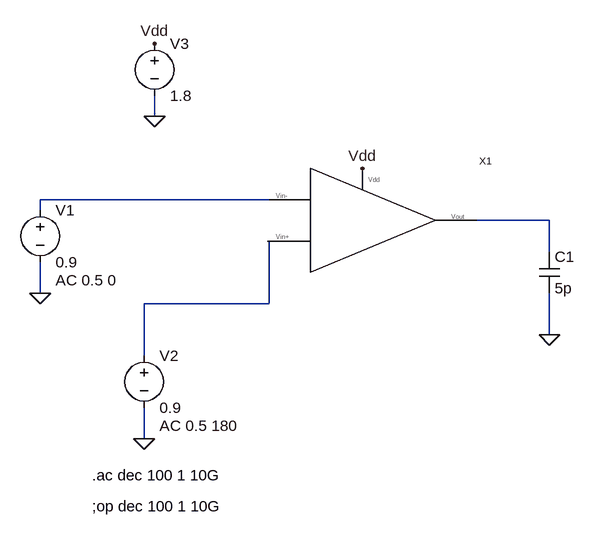
[diagram p0: schematic opamp_ac_simulation.asc]
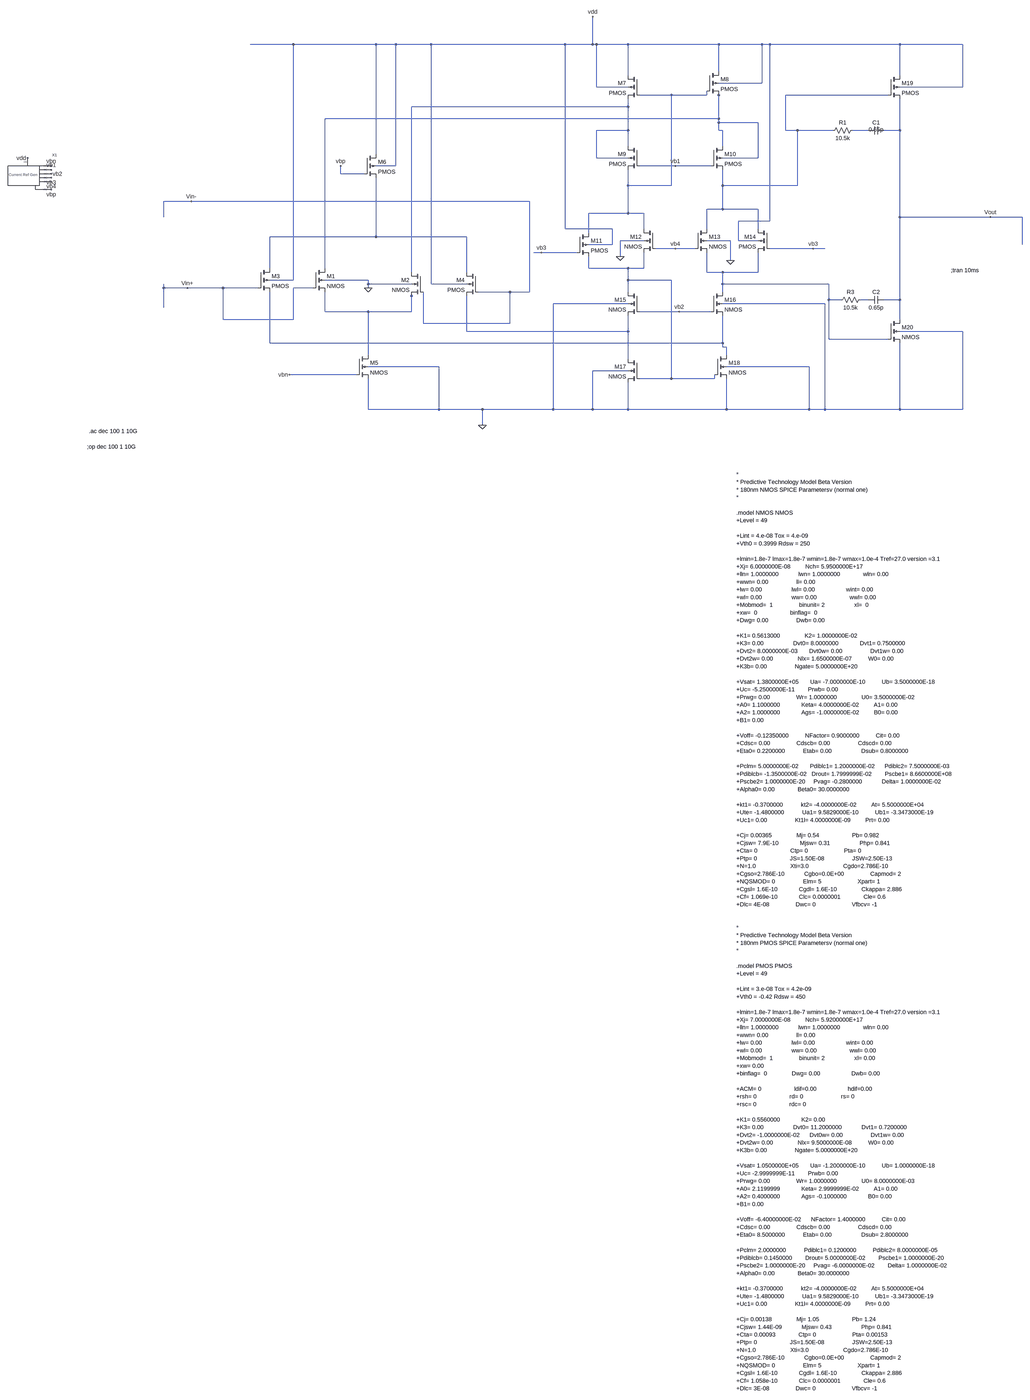
[diagram p1: sub-circuit rail_to_rail_opamp_withclassab_108.5db.asc, whole sheet]
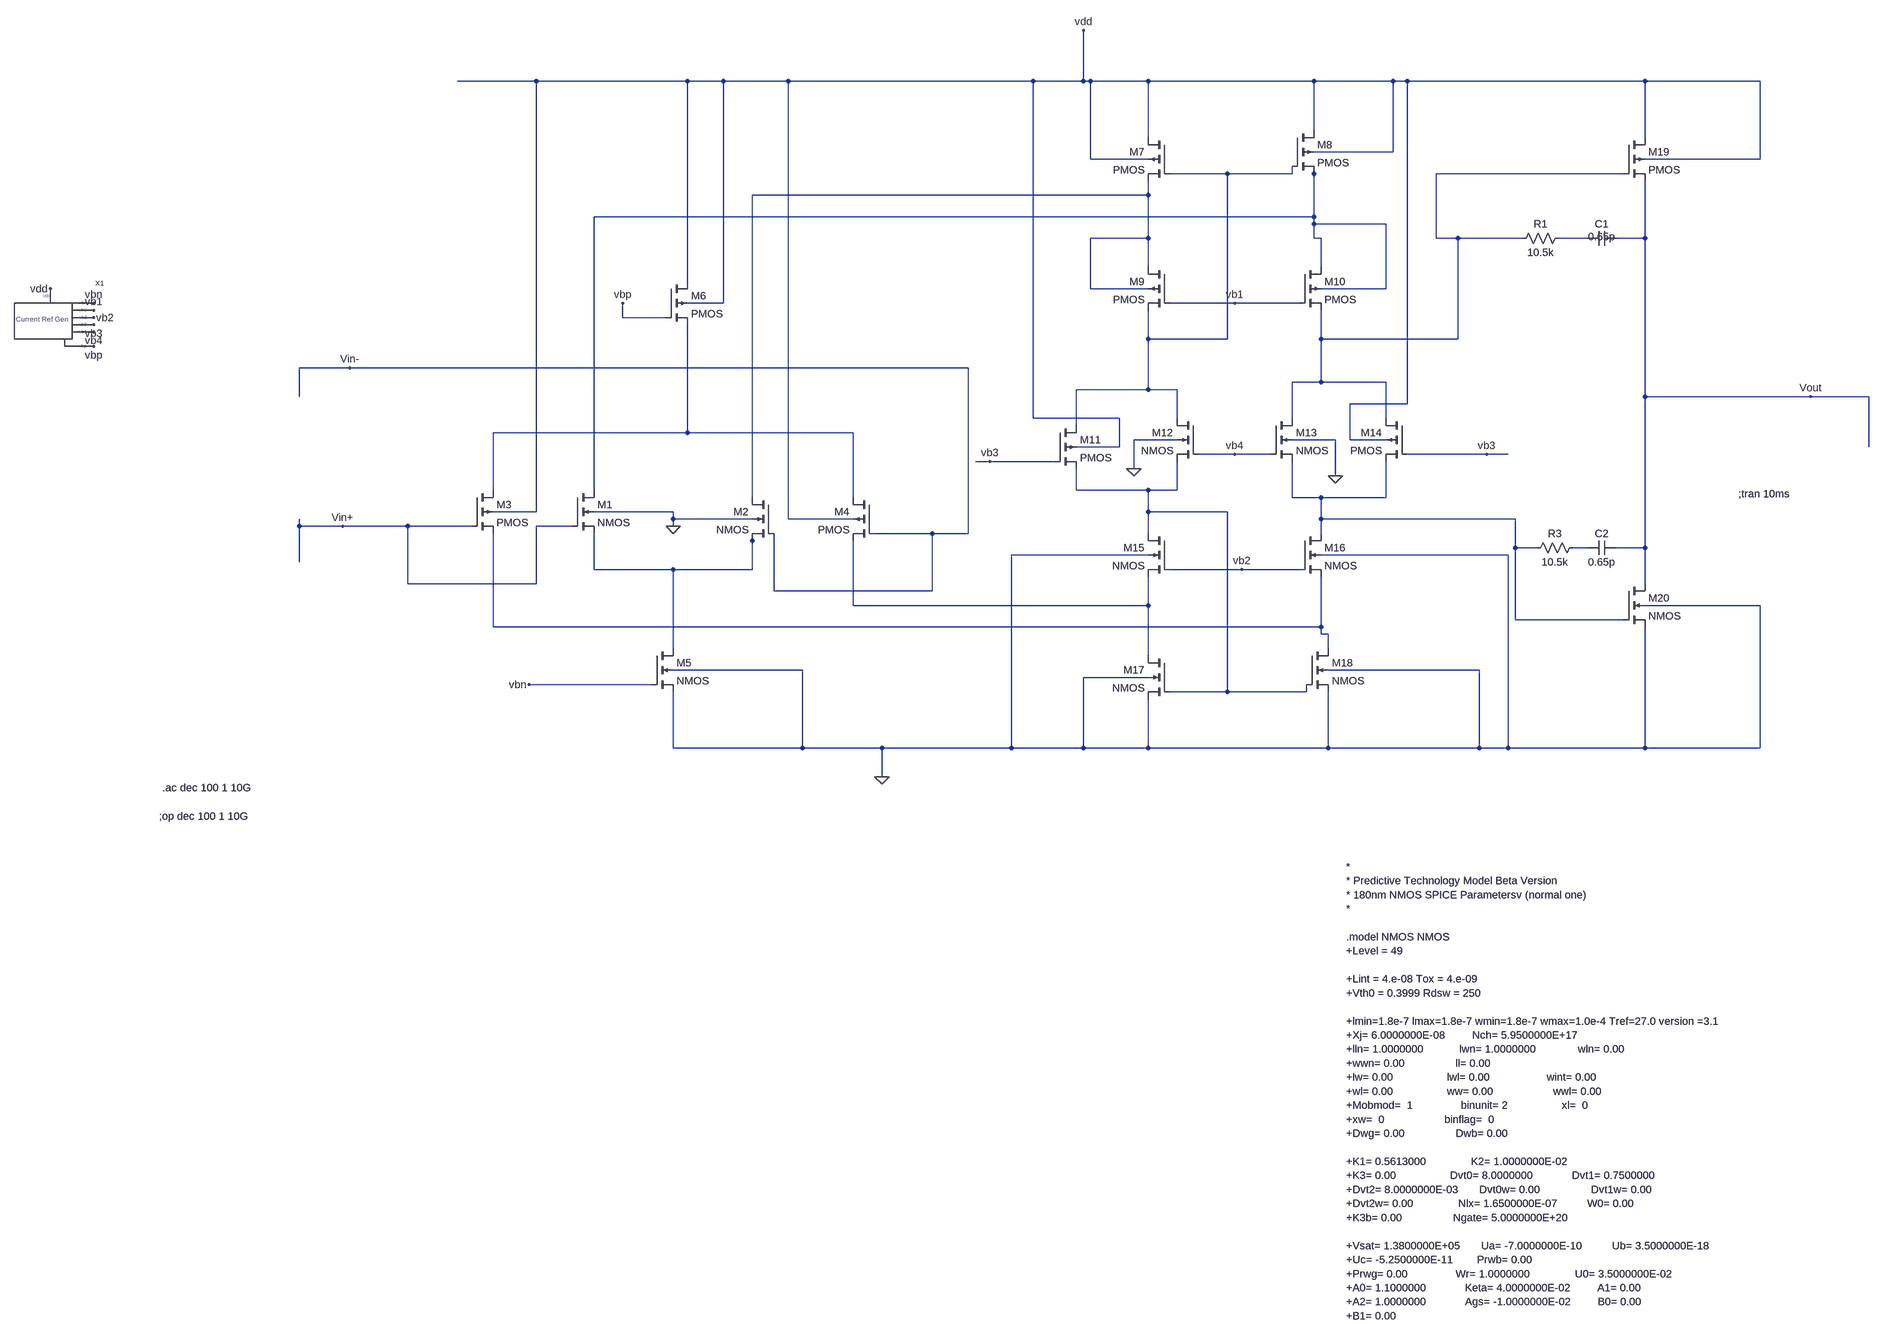
[diagram p2: sub-circuit rail_to_rail_opamp_withclassab_108.5db.asc, part, row 1 of 2, column 1 of 1]
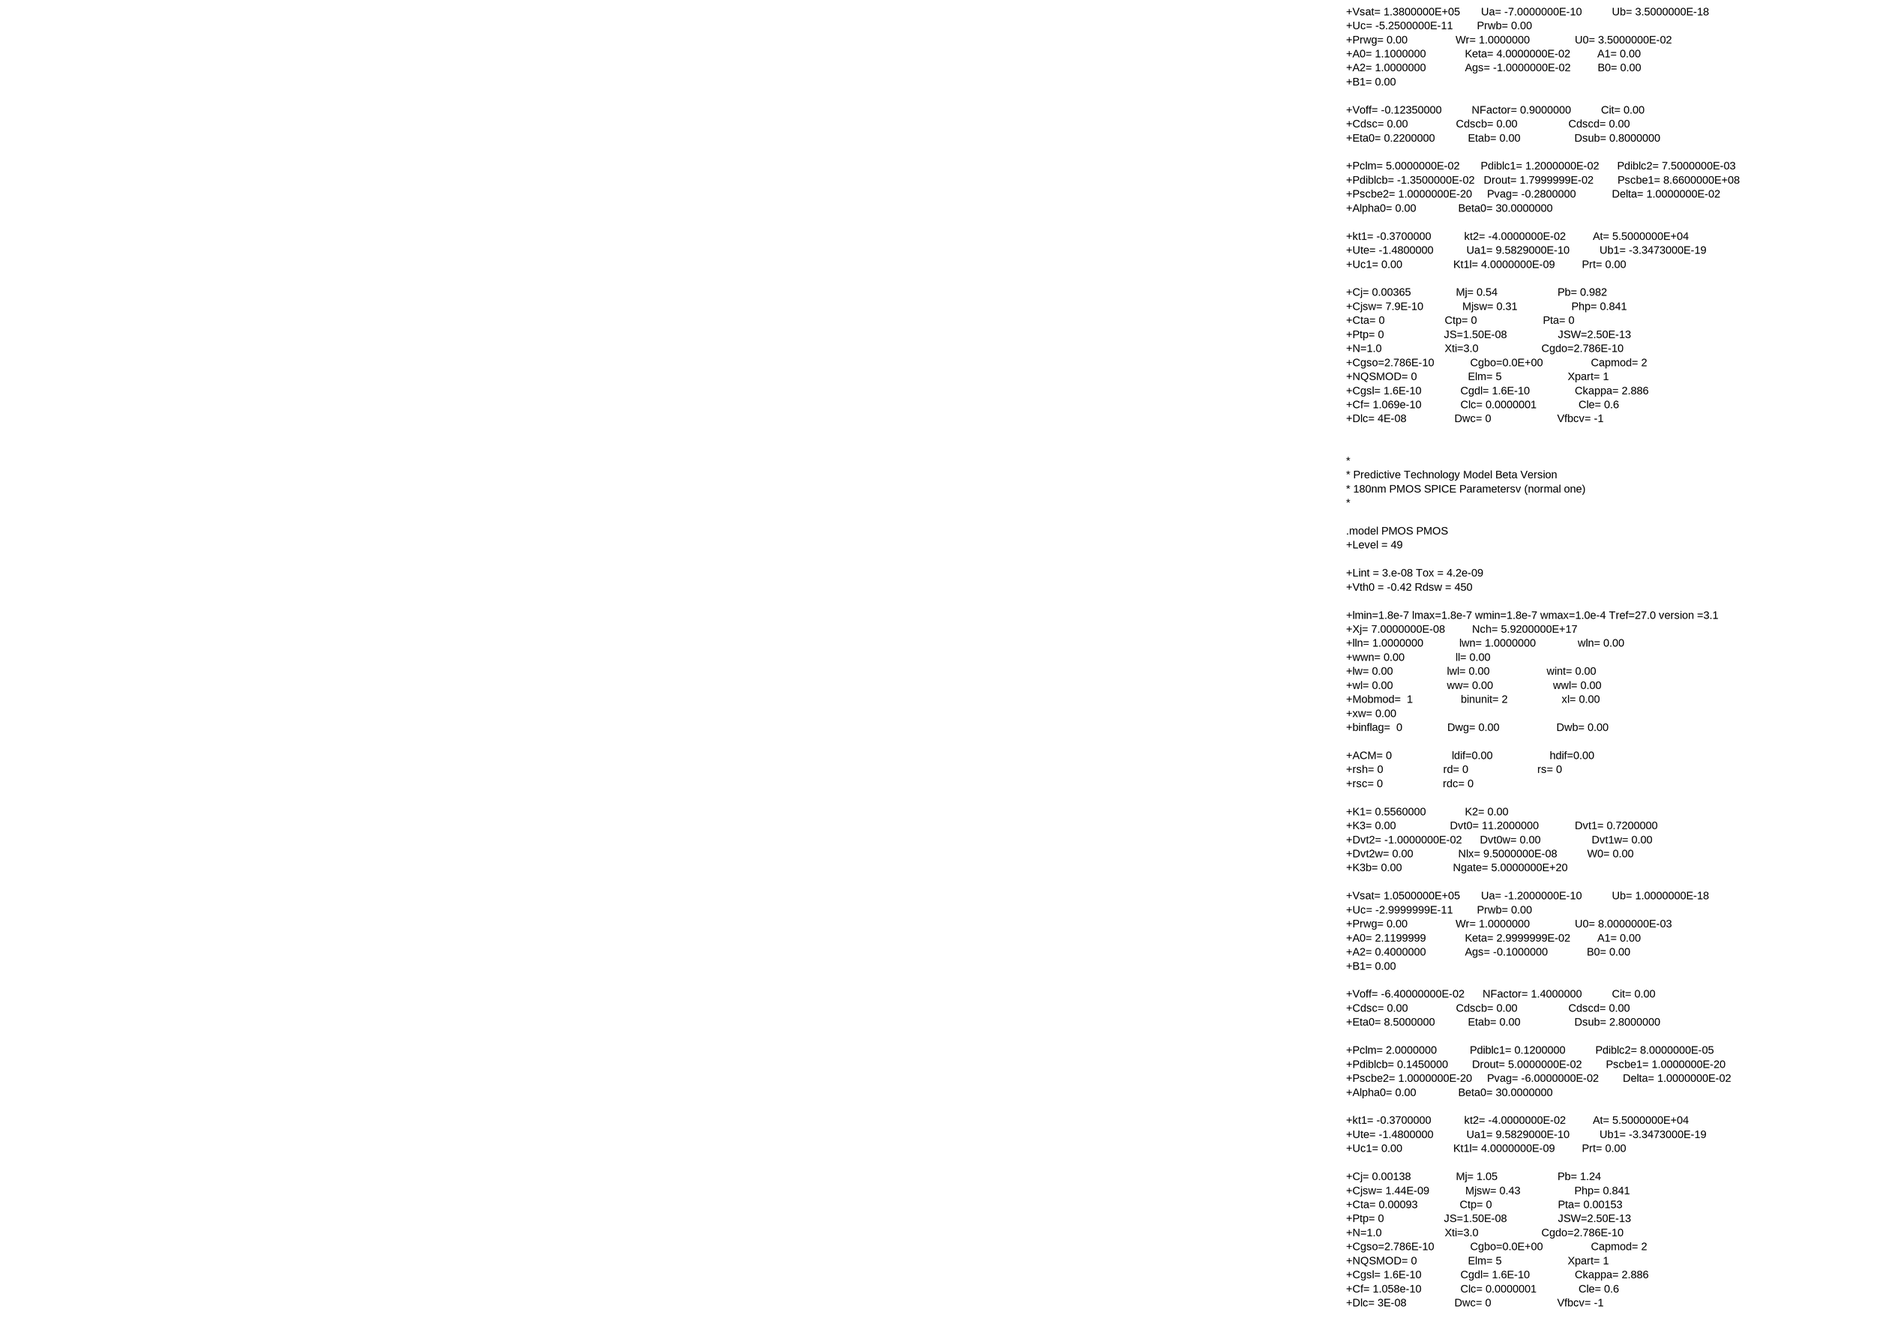
[diagram p3: sub-circuit rail_to_rail_opamp_withclassab_108.5db.asc, part, row 2 of 2, column 1 of 1]
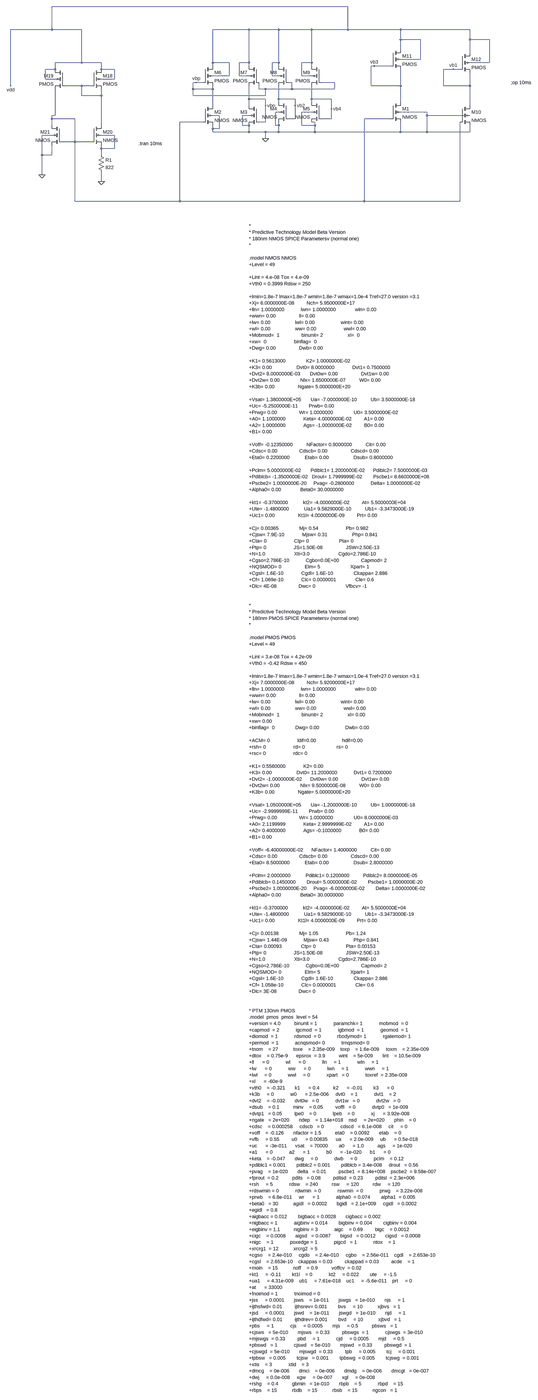
[diagram p4: sub-circuit curr_ref.asc, whole sheet]
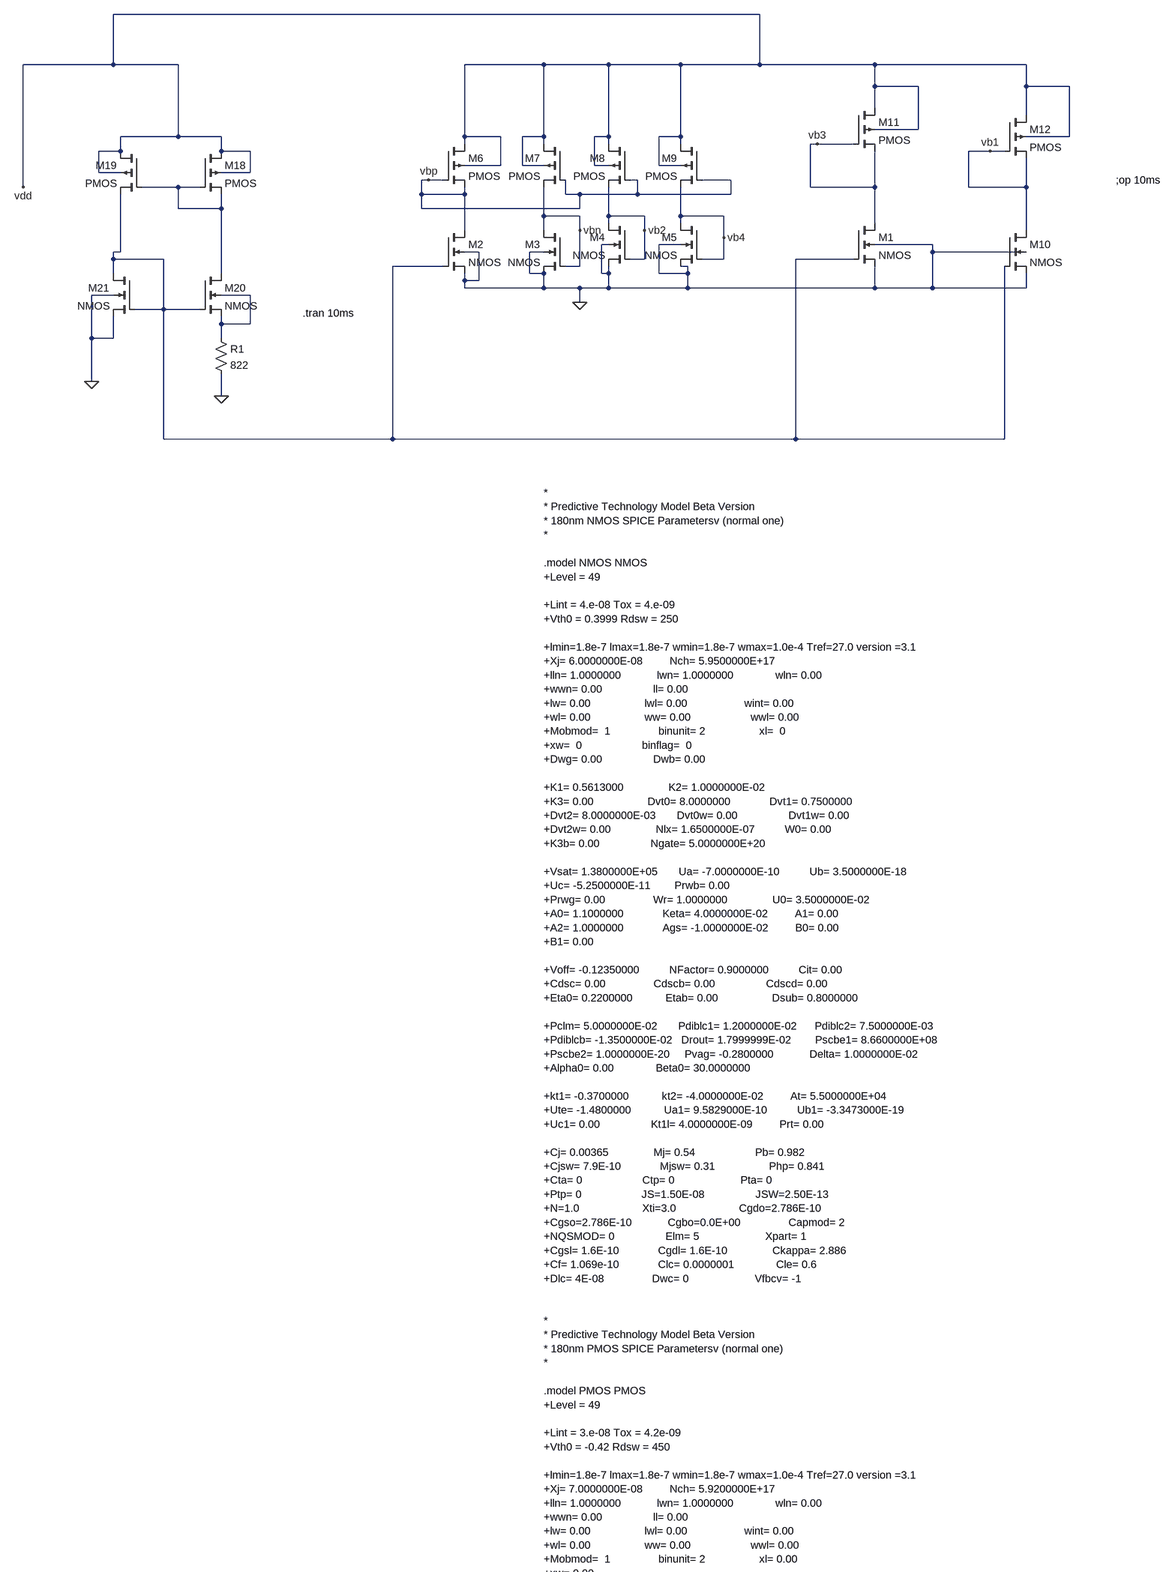
[diagram p5: sub-circuit curr_ref.asc, part, row 1 of 2, column 1 of 1]
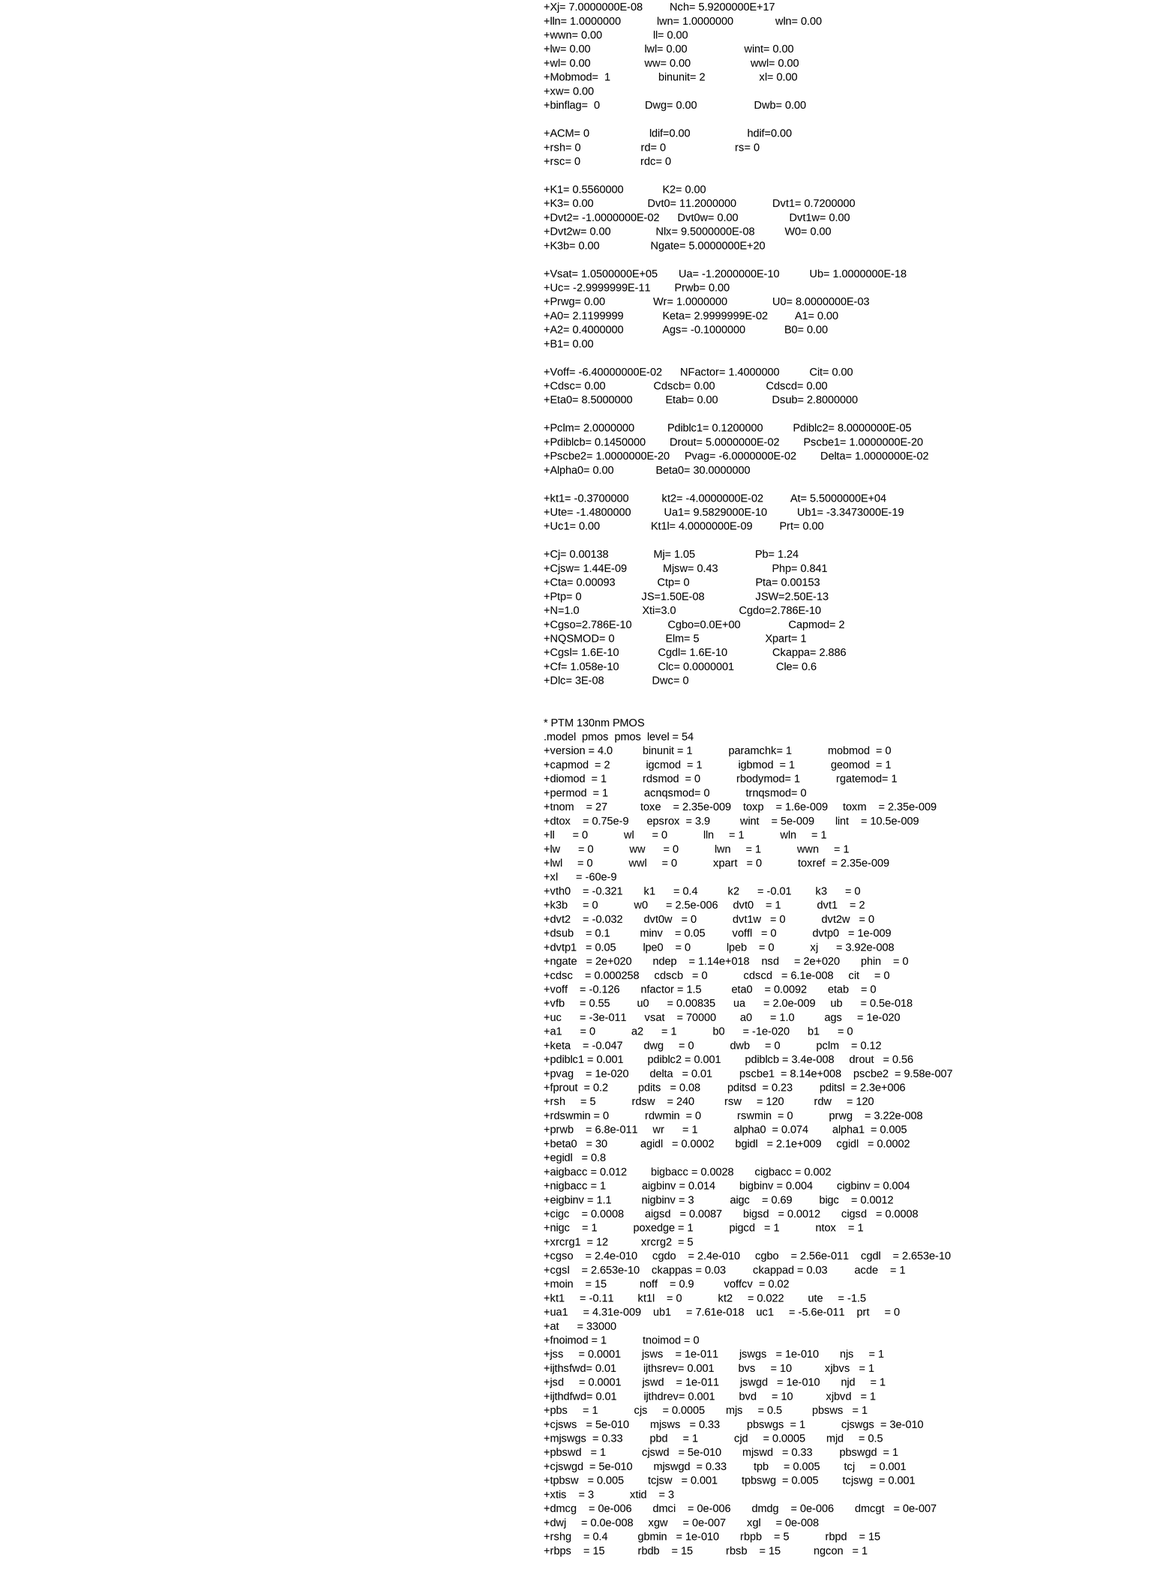
[diagram p6: sub-circuit curr_ref.asc, part, row 2 of 2, column 1 of 1]
opamp_ac_simulation.asc, the LTspice schematic file:
Version 4
SHEET 1 880 680
WIRE -96 16 -96 -16
WIRE 80 144 -272 144
WIRE -272 160 -272 144
WIRE 512 176 400 176
WIRE 512 224 512 176
WIRE -272 288 -272 240
WIRE 80 304 80 208
WIRE 80 304 -112 304
WIRE 512 352 512 288
WIRE -112 384 -112 304
WIRE -112 512 -112 464
FLAG -96 16 0
FLAG -96 -96 Vdd
FLAG 224 96 Vdd
FLAG 512 352 0
FLAG -112 512 0
FLAG -272 288 0
DATAFLAG 480 176 ""
SYMBOL voltage -96 -112 R0
WINDOW 123 0 0 Left 0
WINDOW 39 0 0 Left 0
SYMATTR InstName V3
SYMATTR Value 1.8
SYMBOL cap 496 224 R0
SYMATTR InstName C1
SYMATTR Value 5p
SYMBOL voltage -112 368 R0
WINDOW 123 24 124 Left 2
WINDOW 39 0 0 Left 0
SYMATTR Value2 AC 0.5 180
SYMATTR InstName V2
SYMATTR Value 0.9
SYMBOL rail_to_rail_opamp_withclassAB_108.5db 224 176 R0
SYMATTR InstName X1
SYMBOL voltage -272 144 R0
WINDOW 123 24 124 Left 2
WINDOW 39 0 0 Left 0
SYMATTR InstName V1
SYMATTR Value 0.9
SYMATTR Value2 AC 0.5 0
TEXT -192 568 Left 2 !.ac dec 100 1 10G
TEXT -192 616 Left 2 !;op dec 100 1 10G

rail_to_rail_opamp_withclassab_108.5db.asc, the sub-circuit schematic file:
Version 4
SHEET 1 3040 4552
WIRE -144 -704 -320 -704
WIRE 192 -704 -144 -704
WIRE 272 -704 192 -704
WIRE 416 -704 272 -704
WIRE 960 -704 416 -704
WIRE 1072 -704 1072 -912
WIRE 1072 -704 960 -704
WIRE 1088 -704 1072 -704
WIRE 1216 -704 1088 -704
WIRE 1584 -704 1216 -704
WIRE 1760 -704 1584 -704
WIRE 1792 -704 1760 -704
WIRE 2320 -704 1792 -704
WIRE 2576 -704 2320 -704
WIRE 1584 -576 1584 -704
WIRE 1216 -560 1216 -704
WIRE 2320 -560 2320 -704
WIRE 1760 -528 1760 -704
WIRE 1760 -528 1584 -528
WIRE 1088 -512 1088 -704
WIRE 1216 -512 1088 -512
WIRE 2576 -512 2576 -704
WIRE 2576 -512 2320 -512
WIRE 1392 -480 1264 -480
WIRE 1536 -480 1536 -496
WIRE 1536 -480 1392 -480
WIRE 1584 -480 1584 -496
WIRE 2272 -480 1856 -480
WIRE 1216 -432 1216 -464
WIRE 1216 -432 336 -432
WIRE 1584 -384 1584 -480
WIRE 1584 -384 -16 -384
WIRE 1584 -368 1584 -384
WIRE 1744 -368 1584 -368
WIRE 1216 -336 1216 -432
WIRE 1216 -336 1088 -336
WIRE 1584 -336 1584 -368
WIRE 1600 -336 1584 -336
WIRE 1856 -336 1856 -480
WIRE 1904 -336 1856 -336
WIRE 2048 -336 1904 -336
WIRE 2192 -336 2128 -336
WIRE 2320 -336 2320 -464
WIRE 2320 -336 2256 -336
WIRE 1216 -272 1216 -336
WIRE 1600 -272 1600 -336
WIRE 192 -240 192 -704
WIRE 1088 -224 1088 -336
WIRE 1216 -224 1088 -224
WIRE 1744 -224 1744 -368
WIRE 1744 -224 1600 -224
WIRE 272 -192 272 -704
WIRE 272 -192 192 -192
WIRE 1408 -192 1264 -192
WIRE 1552 -192 1408 -192
WIRE 48 -160 48 -192
WIRE 144 -160 48 -160
WIRE 1216 -112 1216 -176
WIRE 1392 -112 1392 -480
WIRE 1392 -112 1216 -112
WIRE 1600 -112 1600 -176
WIRE 1904 -112 1904 -336
WIRE 1904 -112 1600 -112
WIRE -752 -48 -864 -48
WIRE 816 -48 -752 -48
WIRE 1600 -16 1600 -112
WIRE 1600 -16 1536 -16
WIRE 1744 -16 1600 -16
WIRE 1216 0 1216 -112
WIRE 1216 0 1056 0
WIRE 1280 0 1216 0
WIRE -864 16 -864 -48
WIRE 2320 16 2320 -336
WIRE 2688 16 2320 16
WIRE 2976 16 2688 16
WIRE 1792 32 1792 -704
WIRE 1792 32 1664 32
WIRE 960 64 960 -704
WIRE 1152 64 960 64
WIRE 1280 64 1280 0
WIRE 1536 64 1536 -16
WIRE 1744 64 1744 -16
WIRE 1056 80 1056 0
WIRE 192 96 192 -144
WIRE 192 96 -240 96
WIRE 560 96 192 96
WIRE 1280 112 1184 112
WIRE 1632 112 1536 112
WIRE 1664 112 1664 32
WIRE 1744 112 1664 112
WIRE 1152 128 1152 64
WIRE 1152 128 1056 128
WIRE 2976 128 2976 16
WIRE 1408 144 1328 144
WIRE 1488 144 1408 144
WIRE 1968 144 1792 144
WIRE 2016 144 1968 144
WIRE 864 160 832 160
WIRE 1008 160 864 160
WIRE 1184 176 1184 112
WIRE 1632 192 1632 112
WIRE -240 224 -240 96
WIRE -16 224 -16 -384
WIRE 1056 224 1056 176
WIRE 1216 224 1056 224
WIRE 1280 224 1280 160
WIRE 1280 224 1216 224
WIRE 336 240 336 -432
WIRE 560 240 560 96
WIRE 1536 240 1536 160
WIRE 1600 240 1536 240
WIRE 1744 240 1744 160
WIRE 1744 240 1600 240
WIRE -144 272 -144 -704
WIRE -144 272 -240 272
WIRE 160 272 -16 272
WIRE 1216 272 1216 224
WIRE 1392 272 1216 272
WIRE 160 288 160 272
WIRE 336 288 160 288
WIRE 416 288 416 -704
WIRE 560 288 416 288
WIRE 1600 288 1600 240
WIRE 2032 288 1600 288
WIRE -864 304 -864 288
WIRE -768 304 -864 304
WIRE -528 304 -768 304
WIRE -288 304 -528 304
WIRE -64 304 -144 304
WIRE 160 304 160 288
WIRE 736 320 608 320
WIRE 816 320 816 -48
WIRE 816 320 736 320
WIRE 1216 320 1216 272
WIRE 1600 320 1600 288
WIRE 336 336 336 320
WIRE 2032 352 2032 288
WIRE 2080 352 2032 352
WIRE 2192 352 2160 352
WIRE 2320 352 2320 16
WIRE 2320 352 2256 352
WIRE 1216 368 912 368
WIRE 2016 368 1600 368
WIRE -864 384 -864 304
WIRE -16 400 -16 320
WIRE 160 400 -16 400
WIRE 336 400 336 336
WIRE 336 400 160 400
WIRE 1424 400 1264 400
WIRE 1552 400 1424 400
WIRE -528 432 -528 304
WIRE -144 432 -144 304
WIRE -144 432 -528 432
WIRE 2320 432 2320 352
WIRE 384 448 384 320
WIRE 736 448 736 320
WIRE 736 448 384 448
WIRE 560 480 560 336
WIRE 1216 480 1216 416
WIRE 1216 480 560 480
WIRE 2576 480 2320 480
WIRE 2032 512 2032 352
WIRE 2272 512 2032 512
WIRE -240 528 -240 320
WIRE 1600 528 1600 416
WIRE 1600 528 -240 528
WIRE 1600 544 1600 528
WIRE 1616 544 1600 544
WIRE 160 576 160 400
WIRE 1616 576 1616 544
WIRE 1216 592 1216 480
WIRE 448 624 160 624
WIRE 1952 624 1616 624
WIRE 1216 640 1072 640
WIRE 112 656 -160 656
WIRE 1392 672 1392 272
WIRE 1392 672 1264 672
WIRE 1568 672 1568 656
WIRE 1568 672 1392 672
WIRE 160 912 160 672
WIRE 448 912 448 624
WIRE 448 912 160 912
WIRE 624 912 448 912
WIRE 912 912 912 368
WIRE 912 912 624 912
WIRE 1072 912 1072 640
WIRE 1072 912 912 912
WIRE 1216 912 1216 688
WIRE 1216 912 1072 912
WIRE 1616 912 1616 672
WIRE 1616 912 1216 912
WIRE 1952 912 1952 624
WIRE 1952 912 1616 912
WIRE 2016 912 2016 368
WIRE 2016 912 1952 912
WIRE 2320 912 2320 528
WIRE 2320 912 2016 912
WIRE 2576 912 2576 480
WIRE 2576 912 2320 912
WIRE 624 976 624 912
FLAG 160 304 0
FLAG 624 976 0
FLAG 1184 176 0
FLAG 1632 192 0
FLAG 1424 400 vb2
FLAG 1408 144 vb4
FLAG 1408 -192 vb1
FLAG 1968 144 vb3
FLAG 864 160 vb3
FLAG 1072 -912 vdd
FLAG 48 -192 vbp
FLAG -160 656 vbn
FLAG -2224 -224 vdd
FLAG -2128 -192 vbn
FLAG -2128 -176 vb1
FLAG -2128 -160 vb2
FLAG -2128 -144 vb3
FLAG -2128 -128 vb4
FLAG -2128 -96 vbp
FLAG -752 -48 Vin-
FLAG -768 304 Vin+
FLAG 2688 16 Vout
DATAFLAG 1984 -112 ""
DATAFLAG 2000 304 ""
DATAFLAG 1808 -112 ""
DATAFLAG 1824 288 ""
DATAFLAG 2832 16 ""
DATAFLAG 976 160 ""
DATAFLAG 1376 144 ""
DATAFLAG 1392 -304 ""
DATAFLAG 1488 -192 ""
DATAFLAG 1472 400 ""
DATAFLAG 416 112 "$-V(N002)"
SYMBOL nmos4 -64 224 R0
SYMATTR InstName M1
SYMATTR Value2 l=1u w=27u ad=9.72p as=9.72p pd=54.72u ps=54.72u
SYMBOL nmos4 384 240 M0
SYMATTR InstName M2
SYMATTR Value2 l=1u w=27u ad=9.72p as=9.72p pd=54.72u ps=54.72u
SYMBOL nmos4 112 576 R0
SYMATTR InstName M5
SYMATTR Value2 l=1u w=20u ad=7.2p as=7.2p pd=40.72u ps=40.72u
SYMBOL nmos4 1568 576 R0
SYMATTR InstName M18
SYMATTR Value2 l=1u w=4.1u ad=1.476p as=1.476p pd=8.92u ps=8.92u
SYMBOL nmos4 1552 320 R0
SYMATTR InstName M16
SYMATTR Value2 l=1u w=3.5u ad=1.26p as=1.26p pd=7.72u ps=7.72u
SYMBOL nmos4 1264 320 M0
SYMATTR InstName M15
SYMATTR Value2 l=1u w=3.5u ad=1.26p as=1.26p pd=7.72u ps=7.72u
SYMBOL nmos4 1264 592 M0
SYMATTR InstName M17
SYMATTR Value2 l=1u w=4.1u ad=1.476p as=1.476p pd=8.92u ps=8.92u
SYMBOL nmos4 1328 64 M0
SYMATTR InstName M12
SYMATTR Value2 l=1u w=2u ad=0.72p as=0.72p pd=4.72u ps=4.72u
SYMBOL nmos4 1488 64 R0
SYMATTR InstName M13
SYMATTR Value2 l=1u w=2u ad=0.72p as=0.72p pd=4.72u ps=4.72u
SYMBOL pmos4 -288 224 R0
SYMATTR InstName M3
SYMATTR Value2 l=1u w=72.8u ad=26.2p as=26.2p pd=146.3u ps=146.3u
SYMBOL pmos4 608 240 M0
SYMATTR InstName M4
SYMATTR Value2 l=1u w=72.8u ad=26.2p as=26.2p pd=146.3u ps=146.3u
SYMBOL pmos4 144 -240 R0
SYMATTR InstName M6
SYMATTR Value2 l=1u w=110u ad=39.6p as=39.6p pd=220.72u ps=220.72u
SYMBOL pmos4 1008 80 R0
SYMATTR InstName M11
SYMATTR Value2 l=1u w=9u ad=3.24p as=3.24p pd=18.72u ps=18.72u
SYMBOL pmos4 1552 -272 R0
SYMATTR InstName M10
SYMATTR Value2 l=1u w=15u ad=5.4p as=5.4p pd=30.72u ps=30.72u
SYMBOL pmos4 1536 -576 R0
SYMATTR InstName M8
SYMATTR Value2 l=1u w=36u ad=12.96p as=12.96p pd=72.72u ps=72.72u
SYMBOL pmos4 1264 -560 M0
SYMATTR InstName M7
SYMATTR Value2 l=1u w=36u ad=12.96p as=12.96p pd=72.72u ps=72.72
SYMBOL pmos4 1264 -272 M0
SYMATTR InstName M9
SYMATTR Value2 l=1u w=15u ad=5.4p as=5.4p pd=30.72u ps=30.72u
SYMBOL pmos4 1792 64 M0
SYMATTR InstName M14
SYMATTR Value2 l=1u w=9u ad=3.24p as=3.24p pd=18.72u ps=18.72u
SYMBOL pmos4 2272 -560 R0
SYMATTR InstName M19
SYMATTR Value2 l=0.25u w=65u ad=23p as=23p pd=130u ps=130u
SYMBOL nmos4 2272 432 R0
SYMATTR InstName M20
SYMATTR Value2 l=0.25u w=28.7u ad=9p as=9p pd=50u ps=50u
SYMBOL cap 2256 -352 R90
WINDOW 0 0 32 VBottom 2
WINDOW 3 28 32 VBottom 2
SYMATTR InstName C1
SYMATTR Value 0.65p
SYMBOL cap 2256 336 R90
WINDOW 0 0 32 VBottom 2
WINDOW 3 32 32 VTop 2
SYMATTR InstName C2
SYMATTR Value 0.65p
SYMBOL res 2144 -352 R90
WINDOW 0 0 56 VBottom 2
WINDOW 3 32 56 VTop 2
SYMATTR InstName R1
SYMATTR Value 10.5k
SYMBOL res 2176 336 R90
WINDOW 0 0 56 VBottom 2
WINDOW 3 32 56 VTop 2
SYMATTR InstName R3
SYMATTR Value 10.5k
SYMBOL curr_ref -2240 -160 R0
SYMATTR InstName X1
TEXT -1728 1000 Left 2 !.ac dec 100 1 10G
TEXT 1656 1176 Left 2 !*\n* Predictive Technology Model Beta Version\n* 180nm NMOS SPICE Parametersv (normal one)\n*\n \n.model NMOS NMOS\n+Level = 49\n \n+Lint = 4.e-08 Tox = 4.e-09 \n+Vth0 = 0.3999 Rdsw = 250 \n \n+lmin=1.8e-7 lmax=1.8e-7 wmin=1.8e-7 wmax=1.0e-4 Tref=27.0 version =3.1\n+Xj= 6.0000000E-08         Nch= 5.9500000E+17 \n+lln= 1.0000000            lwn= 1.0000000              wln= 0.00\n+wwn= 0.00                 ll= 0.00\n+lw= 0.00                  lwl= 0.00                   wint= 0.00\n+wl= 0.00                  ww= 0.00                    wwl= 0.00\n+Mobmod=  1                binunit= 2                  xl=  0\n+xw=  0                    binflag=  0\n+Dwg= 0.00                 Dwb= 0.00 \n \n+K1= 0.5613000               K2= 1.0000000E-02 \n+K3= 0.00                  Dvt0= 8.0000000             Dvt1= 0.7500000 \n+Dvt2= 8.0000000E-03       Dvt0w= 0.00                 Dvt1w= 0.00 \n+Dvt2w= 0.00               Nlx= 1.6500000E-07          W0= 0.00 \n+K3b= 0.00                 Ngate= 5.0000000E+20 \n \n+Vsat= 1.3800000E+05       Ua= -7.0000000E-10          Ub= 3.5000000E-18 \n+Uc= -5.2500000E-11        Prwb= 0.00 \n+Prwg= 0.00                Wr= 1.0000000               U0= 3.5000000E-02 \n+A0= 1.1000000             Keta= 4.0000000E-02         A1= 0.00 \n+A2= 1.0000000             Ags= -1.0000000E-02         B0= 0.00 \n+B1= 0.00 \n \n+Voff= -0.12350000          NFactor= 0.9000000          Cit= 0.00 \n+Cdsc= 0.00                Cdscb= 0.00                 Cdscd= 0.00 \n+Eta0= 0.2200000           Etab= 0.00                  Dsub= 0.8000000 \n \n+Pclm= 5.0000000E-02       Pdiblc1= 1.2000000E-02      Pdiblc2= 7.5000000E-03 \n+Pdiblcb= -1.3500000E-02   Drout= 1.7999999E-02        Pscbe1= 8.6600000E+08 \n+Pscbe2= 1.0000000E-20     Pvag= -0.2800000            Delta= 1.0000000E-02 \n+Alpha0= 0.00              Beta0= 30.0000000 \n \n+kt1= -0.3700000           kt2= -4.0000000E-02         At= 5.5000000E+04 \n+Ute= -1.4800000           Ua1= 9.5829000E-10          Ub1= -3.3473000E-19 \n+Uc1= 0.00                 Kt1l= 4.0000000E-09         Prt= 0.00 \n \n+Cj= 0.00365               Mj= 0.54                    Pb= 0.982\n+Cjsw= 7.9E-10             Mjsw= 0.31                  Php= 0.841\n+Cta= 0                    Ctp= 0                      Pta= 0\n+Ptp= 0                    JS=1.50E-08                 JSW=2.50E-13\n+N=1.0                     Xti=3.0                     Cgdo=2.786E-10\n+Cgso=2.786E-10            Cgbo=0.0E+00                Capmod= 2\n+NQSMOD= 0                 Elm= 5                      Xpart= 1\n+Cgsl= 1.6E-10             Cgdl= 1.6E-10               Ckappa= 2.886\n+Cf= 1.069e-10             Clc= 0.0000001              Cle= 0.6\n+Dlc= 4E-08                Dwc= 0                      Vfbcv= -1\n \n \n*\n* Predictive Technology Model Beta Version\n* 180nm PMOS SPICE Parametersv (normal one)\n*\n \n.model PMOS PMOS\n+Level = 49\n \n+Lint = 3.e-08 Tox = 4.2e-09 \n+Vth0 = -0.42 Rdsw = 450 \n \n+lmin=1.8e-7 lmax=1.8e-7 wmin=1.8e-7 wmax=1.0e-4 Tref=27.0 version =3.1\n+Xj= 7.0000000E-08         Nch= 5.9200000E+17 \n+lln= 1.0000000            lwn= 1.0000000              wln= 0.00\n+wwn= 0.00                 ll= 0.00\n+lw= 0.00                  lwl= 0.00                   wint= 0.00\n+wl= 0.00                  ww= 0.00                    wwl= 0.00\n+Mobmod=  1                binunit= 2                  xl= 0.00\n+xw= 0.00                  \n+binflag=  0               Dwg= 0.00                   Dwb= 0.00 \n \n+ACM= 0                    ldif=0.00                   hdif=0.00\n+rsh= 0                    rd= 0                       rs= 0\n+rsc= 0                    rdc= 0\n \n+K1= 0.5560000             K2= 0.00 \n+K3= 0.00                  Dvt0= 11.2000000            Dvt1= 0.7200000 \n+Dvt2= -1.0000000E-02      Dvt0w= 0.00                 Dvt1w= 0.00 \n+Dvt2w= 0.00               Nlx= 9.5000000E-08          W0= 0.00 \n+K3b= 0.00                 Ngate= 5.0000000E+20 \n \n+Vsat= 1.0500000E+05       Ua= -1.2000000E-10          Ub= 1.0000000E-18 \n+Uc= -2.9999999E-11        Prwb= 0.00 \n+Prwg= 0.00                Wr= 1.0000000               U0= 8.0000000E-03 \n+A0= 2.1199999             Keta= 2.9999999E-02         A1= 0.00 \n+A2= 0.4000000             Ags= -0.1000000             B0= 0.00 \n+B1= 0.00 \n \n+Voff= -6.40000000E-02      NFactor= 1.4000000          Cit= 0.00 \n+Cdsc= 0.00                Cdscb= 0.00                 Cdscd= 0.00 \n+Eta0= 8.5000000           Etab= 0.00                  Dsub= 2.8000000 \n \n+Pclm= 2.0000000           Pdiblc1= 0.1200000          Pdiblc2= 8.0000000E-05 \n+Pdiblcb= 0.1450000        Drout= 5.0000000E-02        Pscbe1= 1.0000000E-20 \n+Pscbe2= 1.0000000E-20     Pvag= -6.0000000E-02        Delta= 1.0000000E-02 \n+Alpha0= 0.00              Beta0= 30.0000000 \n \n+kt1= -0.3700000           kt2= -4.0000000E-02         At= 5.5000000E+04 \n+Ute= -1.4800000           Ua1= 9.5829000E-10          Ub1= -3.3473000E-19 \n+Uc1= 0.00                 Kt1l= 4.0000000E-09         Prt= 0.00 \n \n+Cj= 0.00138               Mj= 1.05                    Pb= 1.24\n+Cjsw= 1.44E-09            Mjsw= 0.43                  Php= 0.841\n+Cta= 0.00093              Ctp= 0                      Pta= 0.00153\n+Ptp= 0                    JS=1.50E-08                 JSW=2.50E-13\n+N=1.0                     Xti=3.0                     Cgdo=2.786E-10\n+Cgso=2.786E-10            Cgbo=0.0E+00                Capmod= 2\n+NQSMOD= 0                 Elm= 5                      Xpart= 1\n+Cgsl= 1.6E-10             Cgdl= 1.6E-10               Ckappa= 2.886\n+Cf= 1.058e-10             Clc= 0.0000001              Cle= 0.6\n+Dlc= 3E-08                Dwc= 0                      Vfbcv= -1
TEXT -1736 1064 Left 2 !;op dec 100 1 10G
TEXT 2528 232 Left 2 !;tran 10ms

curr_ref.asc, the sub-circuit schematic file:
Version 4
SHEET 1 2516 6072
WIRE 928 -304 -624 -304
WIRE -624 -192 -624 -304
WIRE -624 -192 -976 -192
WIRE -480 -192 -624 -192
WIRE 448 -192 272 -192
WIRE 592 -192 448 -192
WIRE 752 -192 592 -192
WIRE 928 -192 928 -304
WIRE 928 -192 752 -192
WIRE 1184 -192 928 -192
WIRE 1520 -192 1184 -192
WIRE 1184 -144 1184 -192
WIRE 1280 -144 1184 -144
WIRE 1520 -144 1520 -192
WIRE 1616 -144 1520 -144
WIRE 1184 -96 1184 -144
WIRE 1520 -80 1520 -144
WIRE 1280 -48 1280 -144
WIRE 1280 -48 1184 -48
WIRE -480 -32 -480 -192
WIRE -480 -32 -608 -32
WIRE -384 -32 -480 -32
WIRE 272 -32 272 -192
WIRE 352 -32 272 -32
WIRE 448 -32 448 -192
WIRE 448 -32 400 -32
WIRE 592 -32 592 -192
WIRE 592 -32 560 -32
WIRE 752 -32 752 -192
WIRE 752 -32 704 -32
WIRE 1616 -32 1616 -144
WIRE 1616 -32 1520 -32
WIRE 272 -16 272 -32
WIRE 448 -16 448 -32
WIRE 592 -16 592 -32
WIRE 752 -16 752 -32
WIRE 1056 -16 1040 -16
WIRE 1136 -16 1056 -16
WIRE -608 0 -608 -32
WIRE -608 0 -656 0
WIRE -384 0 -384 -32
WIRE -320 0 -384 0
WIRE 1440 0 1392 0
WIRE 1472 0 1440 0
WIRE 352 32 352 -32
WIRE 352 32 272 32
WIRE 400 32 400 -32
WIRE 448 32 400 32
WIRE 560 32 560 -32
WIRE 592 32 560 32
WIRE 704 32 704 -32
WIRE 752 32 704 32
WIRE -656 48 -656 0
WIRE -608 48 -656 48
WIRE -320 48 -320 0
WIRE -320 48 -384 48
WIRE 192 64 176 64
WIRE 224 64 192 64
WIRE 656 64 640 64
WIRE 864 64 800 64
WIRE -976 80 -976 -192
WIRE -480 80 -560 80
WIRE -432 80 -480 80
WIRE 1040 80 1040 -16
WIRE 1184 80 1184 0
WIRE 1184 80 1040 80
WIRE 1392 80 1392 0
WIRE 1520 80 1520 16
WIRE 1520 80 1392 80
WIRE 176 96 176 64
WIRE 272 96 272 80
WIRE 272 96 176 96
WIRE 496 96 496 64
WIRE 528 96 496 96
WIRE 656 96 656 64
WIRE 656 96 528 96
WIRE 864 96 864 64
WIRE 864 96 656 96
WIRE -480 128 -480 80
WIRE -384 128 -384 96
WIRE -384 128 -480 128
WIRE 176 128 176 96
WIRE 528 128 528 96
WIRE 528 128 176 128
WIRE 448 144 448 80
WIRE 528 144 448 144
WIRE 592 144 592 80
WIRE 672 144 592 144
WIRE 752 144 752 80
WIRE 848 144 752 144
WIRE 592 160 592 144
WIRE 752 160 752 144
WIRE 1184 160 1184 80
WIRE 272 176 272 96
WIRE 448 176 448 144
WIRE 528 176 528 144
WIRE 672 176 672 144
WIRE 1520 176 1520 80
WIRE 848 192 848 144
WIRE 592 208 576 208
WIRE 752 208 704 208
WIRE 1312 208 1184 208
WIRE -608 224 -608 96
WIRE -608 224 -624 224
WIRE 304 224 272 224
WIRE 448 224 416 224
WIRE 1312 224 1312 208
WIRE 1520 224 1312 224
WIRE -624 240 -624 224
WIRE -512 240 -624 240
WIRE 672 240 672 176
WIRE 672 240 640 240
WIRE 848 240 848 192
WIRE 848 240 800 240
WIRE 1136 240 1008 240
WIRE 224 256 112 256
WIRE 528 256 528 176
WIRE 528 256 496 256
WIRE 768 256 752 256
WIRE -624 272 -624 240
WIRE -384 272 -384 128
WIRE 416 272 416 224
WIRE 448 272 416 272
WIRE 576 272 576 208
WIRE 592 272 592 256
WIRE 592 272 576 272
WIRE 704 272 704 208
WIRE 768 272 768 256
WIRE 768 272 704 272
WIRE 272 288 272 272
WIRE 304 288 304 224
WIRE 304 288 272 288
WIRE 272 304 272 288
WIRE 448 304 448 272
WIRE 448 304 272 304
WIRE 528 304 448 304
WIRE 592 304 592 272
WIRE 592 304 528 304
WIRE 768 304 768 272
WIRE 768 304 592 304
WIRE 1184 304 1184 256
WIRE 1184 304 768 304
WIRE 1312 304 1312 224
WIRE 1312 304 1184 304
WIRE 1520 304 1520 272
WIRE 1520 304 1312 304
WIRE -624 320 -672 320
WIRE -320 320 -384 320
WIRE 528 336 528 304
WIRE -512 352 -512 240
WIRE -512 352 -576 352
WIRE -432 352 -512 352
WIRE -384 384 -384 368
WIRE -320 384 -320 320
WIRE -320 384 -384 384
WIRE -672 416 -672 320
WIRE -624 416 -624 368
WIRE -624 416 -672 416
WIRE -384 416 -384 384
WIRE -672 512 -672 416
WIRE -384 544 -384 496
WIRE -512 640 -512 352
WIRE 112 640 112 256
WIRE 112 640 -512 640
WIRE 1008 640 1008 240
WIRE 1008 640 112 640
WIRE 1472 640 1472 256
WIRE 1472 640 1008 640
FLAG 528 336 0
FLAG -384 544 0
FLAG -672 512 0
FLAG 192 64 vbp
FLAG 1056 -16 vb3
FLAG 1440 0 vb1
FLAG 528 176 vbn
FLAG 672 176 vb2
FLAG 848 192 vb4
FLAG -976 80 vdd
DATAFLAG 832 144 ""
DATAFLAG 656 144 ""
DATAFLAG 480 144 ""
DATAFLAG 1392 48 ""
DATAFLAG 1040 64 ""
DATAFLAG 192 128 ""
SYMBOL nmos4 224 176 R0
SYMATTR InstName M2
SYMATTR Value2 l=1u w=37.3u
SYMBOL nmos4 496 176 M0
SYMATTR InstName M3
SYMATTR Value2 l=1u w=55.5u
SYMBOL nmos4 640 160 M0
SYMATTR InstName M4
SYMATTR Value2 l=1u w=23.4u
SYMBOL nmos4 800 160 M0
SYMATTR InstName M5
SYMATTR Value2 l=1u w=5u
SYMBOL pmos4 224 -16 R0
SYMATTR InstName M6
SYMATTR Value2 l=1u w=2u
SYMBOL pmos4 496 -16 M0
SYMATTR InstName M7
SYMATTR Value2 l=1u w=50u
SYMBOL pmos4 640 -16 M0
SYMATTR InstName M8
SYMATTR Value2 l=1u w=120u
SYMBOL pmos4 800 -16 M0
SYMATTR InstName M9
SYMATTR Value2 l=1u w=91.8u
SYMBOL pmos4 -432 0 R0
SYMATTR InstName M18
SYMATTR Value2 l=1u w=400u
SYMBOL pmos4 -560 0 M0
SYMATTR InstName M19
SYMATTR Value2 l=1u w=400u
SYMBOL nmos4 -432 272 R0
SYMATTR InstName M20
SYMATTR Value2 l=1u w=850u
SYMBOL nmos4 -576 272 M0
SYMATTR InstName M21
SYMATTR Value2 l=1u w=400u
SYMBOL res -400 400 R0
SYMATTR InstName R1
SYMATTR Value 822
SYMBOL nmos4 1136 160 R0
SYMATTR InstName M1
SYMATTR Value2 l=1u w=400u
SYMBOL nmos4 1472 176 R0
SYMATTR InstName M10
SYMATTR Value2 l=1u w=400u
SYMBOL pmos4 1136 -96 R0
SYMATTR InstName M11
SYMATTR Value2 l=1u w=2.32u
SYMBOL pmos4 1472 -80 R0
SYMATTR InstName M12
SYMATTR Value2 l=1u w=10u
TEXT -88 360 Left 2 !.tran 10ms
TEXT 448 1016 Left 2 !*\n* Predictive Technology Model Beta Version\n* 180nm NMOS SPICE Parametersv (normal one)\n*\n \n.model NMOS NMOS\n+Level = 49\n \n+Lint = 4.e-08 Tox = 4.e-09 \n+Vth0 = 0.3999 Rdsw = 250 \n \n+lmin=1.8e-7 lmax=1.8e-7 wmin=1.8e-7 wmax=1.0e-4 Tref=27.0 version =3.1\n+Xj= 6.0000000E-08         Nch= 5.9500000E+17 \n+lln= 1.0000000            lwn= 1.0000000              wln= 0.00\n+wwn= 0.00                 ll= 0.00\n+lw= 0.00                  lwl= 0.00                   wint= 0.00\n+wl= 0.00                  ww= 0.00                    wwl= 0.00\n+Mobmod=  1                binunit= 2                  xl=  0\n+xw=  0                    binflag=  0\n+Dwg= 0.00                 Dwb= 0.00 \n \n+K1= 0.5613000               K2= 1.0000000E-02 \n+K3= 0.00                  Dvt0= 8.0000000             Dvt1= 0.7500000 \n+Dvt2= 8.0000000E-03       Dvt0w= 0.00                 Dvt1w= 0.00 \n+Dvt2w= 0.00               Nlx= 1.6500000E-07          W0= 0.00 \n+K3b= 0.00                 Ngate= 5.0000000E+20 \n \n+Vsat= 1.3800000E+05       Ua= -7.0000000E-10          Ub= 3.5000000E-18 \n+Uc= -5.2500000E-11        Prwb= 0.00 \n+Prwg= 0.00                Wr= 1.0000000               U0= 3.5000000E-02 \n+A0= 1.1000000             Keta= 4.0000000E-02         A1= 0.00 \n+A2= 1.0000000             Ags= -1.0000000E-02         B0= 0.00 \n+B1= 0.00 \n \n+Voff= -0.12350000          NFactor= 0.9000000          Cit= 0.00 \n+Cdsc= 0.00                Cdscb= 0.00                 Cdscd= 0.00 \n+Eta0= 0.2200000           Etab= 0.00                  Dsub= 0.8000000 \n \n+Pclm= 5.0000000E-02       Pdiblc1= 1.2000000E-02      Pdiblc2= 7.5000000E-03 \n+Pdiblcb= -1.3500000E-02   Drout= 1.7999999E-02        Pscbe1= 8.6600000E+08 \n+Pscbe2= 1.0000000E-20     Pvag= -0.2800000            Delta= 1.0000000E-02 \n+Alpha0= 0.00              Beta0= 30.0000000 \n \n+kt1= -0.3700000           kt2= -4.0000000E-02         At= 5.5000000E+04 \n+Ute= -1.4800000           Ua1= 9.5829000E-10          Ub1= -3.3473000E-19 \n+Uc1= 0.00                 Kt1l= 4.0000000E-09         Prt= 0.00 \n \n+Cj= 0.00365               Mj= 0.54                    Pb= 0.982\n+Cjsw= 7.9E-10             Mjsw= 0.31                  Php= 0.841\n+Cta= 0                    Ctp= 0                      Pta= 0\n+Ptp= 0                    JS=1.50E-08                 JSW=2.50E-13\n+N=1.0                     Xti=3.0                     Cgdo=2.786E-10\n+Cgso=2.786E-10            Cgbo=0.0E+00                Capmod= 2\n+NQSMOD= 0                 Elm= 5                      Xpart= 1\n+Cgsl= 1.6E-10             Cgdl= 1.6E-10               Ckappa= 2.886\n+Cf= 1.069e-10             Clc= 0.0000001              Cle= 0.6\n+Dlc= 4E-08                Dwc= 0                      Vfbcv= -1\n \n\n*\n* Predictive Technology Model Beta Version\n* 180nm PMOS SPICE Parametersv (normal one)\n*\n \n.model PMOS PMOS\n+Level = 49\n \n+Lint = 3.e-08 Tox = 4.2e-09 \n+Vth0 = -0.42 Rdsw = 450 \n \n+lmin=1.8e-7 lmax=1.8e-7 wmin=1.8e-7 wmax=1.0e-4 Tref=27.0 version =3.1\n+Xj= 7.0000000E-08         Nch= 5.9200000E+17 \n+lln= 1.0000000            lwn= 1.0000000              wln= 0.00\n+wwn= 0.00                 ll= 0.00\n+lw= 0.00                  lwl= 0.00                   wint= 0.00\n+wl= 0.00                  ww= 0.00                    wwl= 0.00\n+Mobmod=  1                binunit= 2                  xl= 0.00\n+xw= 0.00                  \n+binflag=  0               Dwg= 0.00                   Dwb= 0.00 \n \n+ACM= 0                    ldif=0.00                   hdif=0.00\n+rsh= 0                    rd= 0                       rs= 0\n+rsc= 0                    rdc= 0\n \n+K1= 0.5560000             K2= 0.00 \n+K3= 0.00                  Dvt0= 11.2000000            Dvt1= 0.7200000 \n+Dvt2= -1.0000000E-02      Dvt0w= 0.00                 Dvt1w= 0.00 \n+Dvt2w= 0.00               Nlx= 9.5000000E-08          W0= 0.00 \n+K3b= 0.00                 Ngate= 5.0000000E+20 \n \n+Vsat= 1.0500000E+05       Ua= -1.2000000E-10          Ub= 1.0000000E-18 \n+Uc= -2.9999999E-11        Prwb= 0.00 \n+Prwg= 0.00                Wr= 1.0000000               U0= 8.0000000E-03 \n+A0= 2.1199999             Keta= 2.9999999E-02         A1= 0.00 \n+A2= 0.4000000             Ags= -0.1000000             B0= 0.00 \n+B1= 0.00 \n \n+Voff= -6.40000000E-02      NFactor= 1.4000000          Cit= 0.00 \n+Cdsc= 0.00                Cdscb= 0.00                 Cdscd= 0.00 \n+Eta0= 8.5000000           Etab= 0.00                  Dsub= 2.8000000 \n \n+Pclm= 2.0000000           Pdiblc1= 0.1200000          Pdiblc2= 8.0000000E-05 \n+Pdiblcb= 0.1450000        Drout= 5.0000000E-02        Pscbe1= 1.0000000E-20 \n+Pscbe2= 1.0000000E-20     Pvag= -6.0000000E-02        Delta= 1.0000000E-02 \n+Alpha0= 0.00              Beta0= 30.0000000 \n \n+kt1= -0.3700000           kt2= -4.0000000E-02         At= 5.5000000E+04 \n+Ute= -1.4800000           Ua1= 9.5829000E-10          Ub1= -3.3473000E-19 \n+Uc1= 0.00                 Kt1l= 4.0000000E-09         Prt= 0.00 \n \n+Cj= 0.00138               Mj= 1.05                    Pb= 1.24\n+Cjsw= 1.44E-09            Mjsw= 0.43                  Php= 0.841\n+Cta= 0.00093              Ctp= 0                      Pta= 0.00153\n+Ptp= 0                    JS=1.50E-08                 JSW=2.50E-13\n+N=1.0                     Xti=3.0                     Cgdo=2.786E-10\n+Cgso=2.786E-10            Cgbo=0.0E+00                Capmod= 2\n+NQSMOD= 0                 Elm= 5                      Xpart= 1\n+Cgsl= 1.6E-10             Cgdl= 1.6E-10               Ckappa= 2.886\n+Cf= 1.058e-10             Clc= 0.0000001              Cle= 0.6\n+Dlc= 3E-08                Dwc= 0 \n \n \n* PTM 130nm PMOS\n.model  pmos  pmos  level = 54\n+version = 4.0          binunit = 1            paramchk= 1            mobmod  = 0\n+capmod  = 2            igcmod  = 1            igbmod  = 1            geomod  = 1\n+diomod  = 1            rdsmod  = 0            rbodymod= 1            rgatemod= 1\n+permod  = 1            acnqsmod= 0            trnqsmod= 0\n+tnom    = 27           toxe    = 2.35e-009    toxp    = 1.6e-009     toxm    = 2.35e-009\n+dtox    = 0.75e-9      epsrox  = 3.9          wint    = 5e-009       lint    = 10.5e-009\n+ll      = 0            wl      = 0            lln     = 1            wln     = 1\n+lw      = 0            ww      = 0            lwn     = 1            wwn     = 1\n+lwl     = 0            wwl     = 0            xpart   = 0            toxref  = 2.35e-009\n+xl      = -60e-9\n+vth0    = -0.321       k1      = 0.4          k2      = -0.01        k3      = 0\n+k3b     = 0            w0      = 2.5e-006     dvt0    = 1            dvt1    = 2\n+dvt2    = -0.032       dvt0w   = 0            dvt1w   = 0            dvt2w   = 0\n+dsub    = 0.1          minv    = 0.05         voffl   = 0            dvtp0   = 1e-009\n+dvtp1   = 0.05         lpe0    = 0            lpeb    = 0            xj      = 3.92e-008\n+ngate   = 2e+020       ndep    = 1.14e+018    nsd     = 2e+020       phin    = 0\n+cdsc    = 0.000258     cdscb   = 0            cdscd   = 6.1e-008     cit     = 0\n+voff    = -0.126       nfactor = 1.5          eta0    = 0.0092       etab    = 0\n+vfb     = 0.55         u0      = 0.00835      ua      = 2.0e-009     ub      = 0.5e-018\n+uc      = -3e-011      vsat    = 70000        a0      = 1.0          ags     = 1e-020\n+a1      = 0            a2      = 1            b0      = -1e-020      b1      = 0\n+keta    = -0.047       dwg     = 0            dwb     = 0            pclm    = 0.12\n+pdiblc1 = 0.001        pdiblc2 = 0.001        pdiblcb = 3.4e-008     drout   = 0.56\n+pvag    = 1e-020       delta   = 0.01         pscbe1  = 8.14e+008    pscbe2  = 9.58e-007\n+fprout  = 0.2          pdits   = 0.08         pditsd  = 0.23         pditsl  = 2.3e+006\n+rsh     = 5            rdsw    = 240          rsw     = 120          rdw     = 120\n+rdswmin = 0            rdwmin  = 0            rswmin  = 0            prwg    = 3.22e-008\n+prwb    = 6.8e-011     wr      = 1            alpha0  = 0.074        alpha1  = 0.005\n+beta0   = 30           agidl   = 0.0002       bgidl   = 2.1e+009     cgidl   = 0.0002\n+egidl   = 0.8\n+aigbacc = 0.012        bigbacc = 0.0028       cigbacc = 0.002\n+nigbacc = 1            aigbinv = 0.014        bigbinv = 0.004        cigbinv = 0.004\n+eigbinv = 1.1          nigbinv = 3            aigc    = 0.69         bigc    = 0.0012\n+cigc    = 0.0008       aigsd   = 0.0087       bigsd   = 0.0012       cigsd   = 0.0008\n+nigc    = 1            poxedge = 1            pigcd   = 1            ntox    = 1\n+xrcrg1  = 12           xrcrg2  = 5\n+cgso    = 2.4e-010     cgdo    = 2.4e-010     cgbo    = 2.56e-011    cgdl    = 2.653e-10\n+cgsl    = 2.653e-10    ckappas = 0.03         ckappad = 0.03         acde    = 1\n+moin    = 15           noff    = 0.9          voffcv  = 0.02\n+kt1     = -0.11        kt1l    = 0            kt2     = 0.022        ute     = -1.5\n+ua1     = 4.31e-009    ub1     = 7.61e-018    uc1     = -5.6e-011    prt     = 0\n+at      = 33000\n+fnoimod = 1            tnoimod = 0\n+jss     = 0.0001       jsws    = 1e-011       jswgs   = 1e-010       njs     = 1\n+ijthsfwd= 0.01         ijthsrev= 0.001        bvs     = 10           xjbvs   = 1\n+jsd     = 0.0001       jswd    = 1e-011       jswgd   = 1e-010       njd     = 1\n+ijthdfwd= 0.01         ijthdrev= 0.001        bvd     = 10           xjbvd   = 1\n+pbs     = 1            cjs     = 0.0005       mjs     = 0.5          pbsws   = 1\n+cjsws   = 5e-010       mjsws   = 0.33         pbswgs  = 1            cjswgs  = 3e-010\n+mjswgs  = 0.33         pbd     = 1            cjd     = 0.0005       mjd     = 0.5\n+pbswd   = 1            cjswd   = 5e-010       mjswd   = 0.33         pbswgd  = 1\n+cjswgd  = 5e-010       mjswgd  = 0.33         tpb     = 0.005        tcj     = 0.001\n+tpbsw   = 0.005        tcjsw   = 0.001        tpbswg  = 0.005        tcjswg  = 0.001\n+xtis    = 3            xtid    = 3\n+dmcg    = 0e-006       dmci    = 0e-006       dmdg    = 0e-006       dmcgt   = 0e-007\n+dwj     = 0.0e-008     xgw     = 0e-007       xgl     = 0e-008\n+rshg    = 0.4          gbmin   = 1e-010       rbpb    = 5            rbpd    = 15\n+rbps    = 15           rbdb    = 15           rbsb    = 15           ngcon   = 1
TEXT 2408 64 Left 2 !;op 10ms

The netlist it stands for:
* opamp_ac_simulation.asc
V3 Vdd 0 1.8
C1 N002 0 5p
V2 N003 0 0.9 AC 0.5 180
XX1 N001 N003 N002 Vdd rail_to_rail_opamp_withclassab_108.5db
V1 N001 0 0.9 AC 0.5 0

* block symbol definitions
.subckt rail_to_rail_opamp_withclassab_108.5db Vin- Vin+ Vout Vdd
M1 N002 Vin+ N009 0 NMOS l=1u w=27u ad=9.72p as=9.72p pd=54.72u ps=54.72u
M2 N004 Vin- N009 0 NMOS l=1u w=27u ad=9.72p as=9.72p pd=54.72u ps=54.72u
M5 N009 vbn 0 0 NMOS l=1u w=20u ad=7.2p as=7.2p pd=40.72u ps=40.72u
M18 N012 N007 0 0 NMOS l=1u w=4.1u ad=1.476p as=1.476p pd=8.92u ps=8.92u
M16 N008 vb2 N012 0 NMOS l=1u w=3.5u ad=1.26p as=1.26p pd=7.72u ps=7.72u
M15 N007 vb2 N011 0 NMOS l=1u w=3.5u ad=1.26p as=1.26p pd=7.72u ps=7.72u
M17 N011 N007 0 0 NMOS l=1u w=4.1u ad=1.476p as=1.476p pd=8.92u ps=8.92u
M12 N001 vb4 N007 0 NMOS l=1u w=2u ad=0.72p as=0.72p pd=4.72u ps=4.72u
M13 N003 vb4 N008 0 NMOS l=1u w=2u ad=0.72p as=0.72p pd=4.72u ps=4.72u
M3 N006 Vin+ N012 vdd PMOS l=1u w=72.8u ad=26.2p as=26.2p pd=146.3u ps=146.3u
M4 N006 Vin- N011 vdd PMOS l=1u w=72.8u ad=26.2p as=26.2p pd=146.3u ps=146.3u
M6 vdd vbp N006 vdd PMOS l=1u w=110u ad=39.6p as=39.6p pd=220.72u ps=220.72u
M11 N001 vb3 N007 vdd PMOS l=1u w=9u ad=3.24p as=3.24p pd=18.72u ps=18.72u
M10 N002 vb1 N003 N002 PMOS l=1u w=15u ad=5.4p as=5.4p pd=30.72u ps=30.72u
M8 vdd N001 N002 vdd PMOS l=1u w=36u ad=12.96p as=12.96p pd=72.72u ps=72.72u
M7 vdd N001 N004 vdd PMOS l=1u w=36u ad=12.96p as=12.96p pd=72.72u ps=72.72
M9 N004 vb1 N001 N004 PMOS l=1u w=15u ad=5.4p as=5.4p pd=30.72u ps=30.72u
M14 N003 vb3 N008 vdd PMOS l=1u w=9u ad=3.24p as=3.24p pd=18.72u ps=18.72u
M19 vdd N003 Vout vdd PMOS l=0.25u w=65u ad=23p as=23p pd=130u ps=130u
M20 Vout N008 0 0 NMOS l=0.25u w=28.7u ad=9p as=9p pd=50u ps=50u
C1 Vout N005 0.65p
C2 Vout N010 0.65p
R1 N005 N003 10.5k
R3 N010 N008 10.5k
XX1 vdd vbn vb1 vb2 vb3 vb4 vbp curr_ref
.ac dec 100 1 10G
*
* Predictive Technology Model Beta Version
* 180nm NMOS SPICE Parametersv (normal one)
*
.model NMOS NMOS
+Level = 49
+Lint = 4.e-08 Tox = 4.e-09
+Vth0 = 0.3999 Rdsw = 250
+lmin=1.8e-7 lmax=1.8e-7 wmin=1.8e-7 wmax=1.0e-4 Tref=27.0 version =3.1
+Xj= 6.0000000E-08         Nch= 5.9500000E+17
+lln= 1.0000000            lwn= 1.0000000              wln= 0.00
+wwn= 0.00                 ll= 0.00
+lw= 0.00                  lwl= 0.00                   wint= 0.00
+wl= 0.00                  ww= 0.00                    wwl= 0.00
+Mobmod=  1                binunit= 2                  xl=  0
+xw=  0                    binflag=  0
+Dwg= 0.00                 Dwb= 0.00
+K1= 0.5613000               K2= 1.0000000E-02
+K3= 0.00                  Dvt0= 8.0000000             Dvt1= 0.7500000
+Dvt2= 8.0000000E-03       Dvt0w= 0.00                 Dvt1w= 0.00
+Dvt2w= 0.00               Nlx= 1.6500000E-07          W0= 0.00
+K3b= 0.00                 Ngate= 5.0000000E+20
+Vsat= 1.3800000E+05       Ua= -7.0000000E-10          Ub= 3.5000000E-18
+Uc= -5.2500000E-11        Prwb= 0.00
+Prwg= 0.00                Wr= 1.0000000               U0= 3.5000000E-02
+A0= 1.1000000             Keta= 4.0000000E-02         A1= 0.00
+A2= 1.0000000             Ags= -1.0000000E-02         B0= 0.00
+B1= 0.00
+Voff= -0.12350000          NFactor= 0.9000000          Cit= 0.00
+Cdsc= 0.00                Cdscb= 0.00                 Cdscd= 0.00
+Eta0= 0.2200000           Etab= 0.00                  Dsub= 0.8000000
+Pclm= 5.0000000E-02       Pdiblc1= 1.2000000E-02      Pdiblc2= 7.5000000E-03
+Pdiblcb= -1.3500000E-02   Drout= 1.7999999E-02        Pscbe1= 8.6600000E+08
+Pscbe2= 1.0000000E-20     Pvag= -0.2800000            Delta= 1.0000000E-02
+Alpha0= 0.00              Beta0= 30.0000000
+kt1= -0.3700000           kt2= -4.0000000E-02         At= 5.5000000E+04
+Ute= -1.4800000           Ua1= 9.5829000E-10          Ub1= -3.3473000E-19
+Uc1= 0.00                 Kt1l= 4.0000000E-09         Prt= 0.00
+Cj= 0.00365               Mj= 0.54                    Pb= 0.982
+Cjsw= 7.9E-10             Mjsw= 0.31                  Php= 0.841
+Cta= 0                    Ctp= 0                      Pta= 0
+Ptp= 0                    JS=1.50E-08                 JSW=2.50E-13
+N=1.0                     Xti=3.0                     Cgdo=2.786E-10
+Cgso=2.786E-10            Cgbo=0.0E+00                Capmod= 2
+NQSMOD= 0                 Elm= 5                      Xpart= 1
+Cgsl= 1.6E-10             Cgdl= 1.6E-10               Ckappa= 2.886
+Cf= 1.069e-10             Clc= 0.0000001              Cle= 0.6
+Dlc= 4E-08                Dwc= 0                      Vfbcv= -1
*
* Predictive Technology Model Beta Version
* 180nm PMOS SPICE Parametersv (normal one)
*
.model PMOS PMOS
+Level = 49
+Lint = 3.e-08 Tox = 4.2e-09
+Vth0 = -0.42 Rdsw = 450
+lmin=1.8e-7 lmax=1.8e-7 wmin=1.8e-7 wmax=1.0e-4 Tref=27.0 version =3.1
+Xj= 7.0000000E-08         Nch= 5.9200000E+17
+lln= 1.0000000            lwn= 1.0000000              wln= 0.00
+wwn= 0.00                 ll= 0.00
+lw= 0.00                  lwl= 0.00                   wint= 0.00
+wl= 0.00                  ww= 0.00                    wwl= 0.00
+Mobmod=  1                binunit= 2                  xl= 0.00
+xw= 0.00
+binflag=  0               Dwg= 0.00                   Dwb= 0.00
+ACM= 0                    ldif=0.00                   hdif=0.00
+rsh= 0                    rd= 0                       rs= 0
+rsc= 0                    rdc= 0
+K1= 0.5560000             K2= 0.00
+K3= 0.00                  Dvt0= 11.2000000            Dvt1= 0.7200000
+Dvt2= -1.0000000E-02      Dvt0w= 0.00                 Dvt1w= 0.00
+Dvt2w= 0.00               Nlx= 9.5000000E-08          W0= 0.00
+K3b= 0.00                 Ngate= 5.0000000E+20
+Vsat= 1.0500000E+05       Ua= -1.2000000E-10          Ub= 1.0000000E-18
+Uc= -2.9999999E-11        Prwb= 0.00
+Prwg= 0.00                Wr= 1.0000000               U0= 8.0000000E-03
+A0= 2.1199999             Keta= 2.9999999E-02         A1= 0.00
+A2= 0.4000000             Ags= -0.1000000             B0= 0.00
+B1= 0.00
+Voff= -6.40000000E-02      NFactor= 1.4000000          Cit= 0.00
+Cdsc= 0.00                Cdscb= 0.00                 Cdscd= 0.00
+Eta0= 8.5000000           Etab= 0.00                  Dsub= 2.8000000
+Pclm= 2.0000000           Pdiblc1= 0.1200000          Pdiblc2= 8.0000000E-05
+Pdiblcb= 0.1450000        Drout= 5.0000000E-02        Pscbe1= 1.0000000E-20
+Pscbe2= 1.0000000E-20     Pvag= -6.0000000E-02        Delta= 1.0000000E-02
+Alpha0= 0.00              Beta0= 30.0000000
+kt1= -0.3700000           kt2= -4.0000000E-02         At= 5.5000000E+04
+Ute= -1.4800000           Ua1= 9.5829000E-10          Ub1= -3.3473000E-19
+Uc1= 0.00                 Kt1l= 4.0000000E-09         Prt= 0.00
+Cj= 0.00138               Mj= 1.05                    Pb= 1.24
+Cjsw= 1.44E-09            Mjsw= 0.43                  Php= 0.841
+Cta= 0.00093              Ctp= 0                      Pta= 0.00153
+Ptp= 0                    JS=1.50E-08                 JSW=2.50E-13
+N=1.0                     Xti=3.0                     Cgdo=2.786E-10
+Cgso=2.786E-10            Cgbo=0.0E+00                Capmod= 2
+NQSMOD= 0                 Elm= 5                      Xpart= 1
+Cgsl= 1.6E-10             Cgdl= 1.6E-10               Ckappa= 2.886
+Cf= 1.058e-10             Clc= 0.0000001              Cle= 0.6
+Dlc= 3E-08                Dwc= 0                      Vfbcv= -1
;op dec 100 1 10G
;tran 10ms
.ends rail_to_rail_opamp_withclassab_108.5db

.subckt curr_ref vdd vbn vb1 vb2 vb3 vb4 vbp
M2 vbp N002 0 0 NMOS l=1u w=37.3u
M3 vbn vbn 0 0 NMOS l=1u w=55.5u
M4 vb2 vb2 0 0 NMOS l=1u w=23.4u
M5 vb4 vb4 0 0 NMOS l=1u w=5u
M6 vdd vbp vbp vdd PMOS l=1u w=2u
M7 vdd vbp vbn vdd PMOS l=1u w=50u
M8 vdd vbp vb2 vdd PMOS l=1u w=120u
M9 vdd vbp vb4 vdd PMOS l=1u w=91.8u
M18 vdd N001 N001 vdd PMOS l=1u w=400u
M19 vdd N001 N002 vdd PMOS l=1u w=400u
M20 N001 N002 N003 N003 NMOS l=1u w=850u
M21 N002 N002 0 0 NMOS l=1u w=400u
R1 N003 0 822
M1 vb3 N002 0 0 NMOS l=1u w=400u
M10 vb1 N002 0 0 NMOS l=1u w=400u
M11 vdd vb3 vb3 vdd PMOS l=1u w=2.32u
M12 vdd vb1 vb1 vdd PMOS l=1u w=10u
.tran 10ms
*
* Predictive Technology Model Beta Version
* 180nm NMOS SPICE Parametersv (normal one)
*
.model NMOS NMOS
+Level = 49
+Lint = 4.e-08 Tox = 4.e-09
+Vth0 = 0.3999 Rdsw = 250
+lmin=1.8e-7 lmax=1.8e-7 wmin=1.8e-7 wmax=1.0e-4 Tref=27.0 version =3.1
+Xj= 6.0000000E-08         Nch= 5.9500000E+17
+lln= 1.0000000            lwn= 1.0000000              wln= 0.00
+wwn= 0.00                 ll= 0.00
+lw= 0.00                  lwl= 0.00                   wint= 0.00
+wl= 0.00                  ww= 0.00                    wwl= 0.00
+Mobmod=  1                binunit= 2                  xl=  0
+xw=  0                    binflag=  0
+Dwg= 0.00                 Dwb= 0.00
+K1= 0.5613000               K2= 1.0000000E-02
+K3= 0.00                  Dvt0= 8.0000000             Dvt1= 0.7500000
+Dvt2= 8.0000000E-03       Dvt0w= 0.00                 Dvt1w= 0.00
+Dvt2w= 0.00               Nlx= 1.6500000E-07          W0= 0.00
+K3b= 0.00                 Ngate= 5.0000000E+20
+Vsat= 1.3800000E+05       Ua= -7.0000000E-10          Ub= 3.5000000E-18
+Uc= -5.2500000E-11        Prwb= 0.00
+Prwg= 0.00                Wr= 1.0000000               U0= 3.5000000E-02
+A0= 1.1000000             Keta= 4.0000000E-02         A1= 0.00
+A2= 1.0000000             Ags= -1.0000000E-02         B0= 0.00
+B1= 0.00
+Voff= -0.12350000          NFactor= 0.9000000          Cit= 0.00
+Cdsc= 0.00                Cdscb= 0.00                 Cdscd= 0.00
+Eta0= 0.2200000           Etab= 0.00                  Dsub= 0.8000000
+Pclm= 5.0000000E-02       Pdiblc1= 1.2000000E-02      Pdiblc2= 7.5000000E-03
+Pdiblcb= -1.3500000E-02   Drout= 1.7999999E-02        Pscbe1= 8.6600000E+08
+Pscbe2= 1.0000000E-20     Pvag= -0.2800000            Delta= 1.0000000E-02
+Alpha0= 0.00              Beta0= 30.0000000
+kt1= -0.3700000           kt2= -4.0000000E-02         At= 5.5000000E+04
+Ute= -1.4800000           Ua1= 9.5829000E-10          Ub1= -3.3473000E-19
+Uc1= 0.00                 Kt1l= 4.0000000E-09         Prt= 0.00
+Cj= 0.00365               Mj= 0.54                    Pb= 0.982
+Cjsw= 7.9E-10             Mjsw= 0.31                  Php= 0.841
+Cta= 0                    Ctp= 0                      Pta= 0
+Ptp= 0                    JS=1.50E-08                 JSW=2.50E-13
+N=1.0                     Xti=3.0                     Cgdo=2.786E-10
+Cgso=2.786E-10            Cgbo=0.0E+00                Capmod= 2
+NQSMOD= 0                 Elm= 5                      Xpart= 1
+Cgsl= 1.6E-10             Cgdl= 1.6E-10               Ckappa= 2.886
+Cf= 1.069e-10             Clc= 0.0000001              Cle= 0.6
+Dlc= 4E-08                Dwc= 0                      Vfbcv= -1
*
* Predictive Technology Model Beta Version
* 180nm PMOS SPICE Parametersv (normal one)
*
.model PMOS PMOS
+Level = 49
+Lint = 3.e-08 Tox = 4.2e-09
+Vth0 = -0.42 Rdsw = 450
+lmin=1.8e-7 lmax=1.8e-7 wmin=1.8e-7 wmax=1.0e-4 Tref=27.0 version =3.1
+Xj= 7.0000000E-08         Nch= 5.9200000E+17
+lln= 1.0000000            lwn= 1.0000000              wln= 0.00
+wwn= 0.00                 ll= 0.00
+lw= 0.00                  lwl= 0.00                   wint= 0.00
+wl= 0.00                  ww= 0.00                    wwl= 0.00
+Mobmod=  1                binunit= 2                  xl= 0.00
+xw= 0.00
+binflag=  0               Dwg= 0.00                   Dwb= 0.00
+ACM= 0                    ldif=0.00                   hdif=0.00
+rsh= 0                    rd= 0                       rs= 0
+rsc= 0                    rdc= 0
+K1= 0.5560000             K2= 0.00
+K3= 0.00                  Dvt0= 11.2000000            Dvt1= 0.7200000
+Dvt2= -1.0000000E-02      Dvt0w= 0.00                 Dvt1w= 0.00
+Dvt2w= 0.00               Nlx= 9.5000000E-08          W0= 0.00
+K3b= 0.00                 Ngate= 5.0000000E+20
+Vsat= 1.0500000E+05       Ua= -1.2000000E-10          Ub= 1.0000000E-18
+Uc= -2.9999999E-11        Prwb= 0.00
+Prwg= 0.00                Wr= 1.0000000               U0= 8.0000000E-03
+A0= 2.1199999             Keta= 2.9999999E-02         A1= 0.00
+A2= 0.4000000             Ags= -0.1000000             B0= 0.00
+B1= 0.00
+Voff= -6.40000000E-02      NFactor= 1.4000000          Cit= 0.00
+Cdsc= 0.00                Cdscb= 0.00                 Cdscd= 0.00
+Eta0= 8.5000000           Etab= 0.00                  Dsub= 2.8000000
+Pclm= 2.0000000           Pdiblc1= 0.1200000          Pdiblc2= 8.0000000E-05
+Pdiblcb= 0.1450000        Drout= 5.0000000E-02        Pscbe1= 1.0000000E-20
+Pscbe2= 1.0000000E-20     Pvag= -6.0000000E-02        Delta= 1.0000000E-02
+Alpha0= 0.00              Beta0= 30.0000000
+kt1= -0.3700000           kt2= -4.0000000E-02         At= 5.5000000E+04
+Ute= -1.4800000           Ua1= 9.5829000E-10          Ub1= -3.3473000E-19
+Uc1= 0.00                 Kt1l= 4.0000000E-09         Prt= 0.00
+Cj= 0.00138               Mj= 1.05                    Pb= 1.24
+Cjsw= 1.44E-09            Mjsw= 0.43                  Php= 0.841
+Cta= 0.00093              Ctp= 0                      Pta= 0.00153
+Ptp= 0                    JS=1.50E-08                 JSW=2.50E-13
+N=1.0                     Xti=3.0                     Cgdo=2.786E-10
+Cgso=2.786E-10            Cgbo=0.0E+00                Capmod= 2
+NQSMOD= 0                 Elm= 5                      Xpart= 1
+Cgsl= 1.6E-10             Cgdl= 1.6E-10               Ckappa= 2.886
+Cf= 1.058e-10             Clc= 0.0000001              Cle= 0.6
+Dlc= 3E-08                Dwc= 0
* PTM 130nm PMOS
.model  pmos  pmos  level = 54
+version = 4.0          binunit = 1            paramchk= 1            mobmod  = 0
+capmod  = 2            igcmod  = 1            igbmod  = 1            geomod  = 1
+diomod  = 1            rdsmod  = 0            rbodymod= 1            rgatemod= 1
+permod  = 1            acnqsmod= 0            trnqsmod= 0
+tnom    = 27           toxe    = 2.35e-009    toxp    = 1.6e-009     toxm    = 2.35e-009
+dtox    = 0.75e-9      epsrox  = 3.9          wint    = 5e-009       lint    = 10.5e-009
+ll      = 0            wl      = 0            lln     = 1            wln     = 1
+lw      = 0            ww      = 0            lwn     = 1            wwn     = 1
+lwl     = 0            wwl     = 0            xpart   = 0            toxref  = 2.35e-009
+xl      = -60e-9
+vth0    = -0.321       k1      = 0.4          k2      = -0.01        k3      = 0
+k3b     = 0            w0      = 2.5e-006     dvt0    = 1            dvt1    = 2
+dvt2    = -0.032       dvt0w   = 0            dvt1w   = 0            dvt2w   = 0
+dsub    = 0.1          minv    = 0.05         voffl   = 0            dvtp0   = 1e-009
+dvtp1   = 0.05         lpe0    = 0            lpeb    = 0            xj      = 3.92e-008
+ngate   = 2e+020       ndep    = 1.14e+018    nsd     = 2e+020       phin    = 0
+cdsc    = 0.000258     cdscb   = 0            cdscd   = 6.1e-008     cit     = 0
+voff    = -0.126       nfactor = 1.5          eta0    = 0.0092       etab    = 0
+vfb     = 0.55         u0      = 0.00835      ua      = 2.0e-009     ub      = 0.5e-018
+uc      = -3e-011      vsat    = 70000        a0      = 1.0          ags     = 1e-020
+a1      = 0            a2      = 1            b0      = -1e-020      b1      = 0
+keta    = -0.047       dwg     = 0            dwb     = 0            pclm    = 0.12
+pdiblc1 = 0.001        pdiblc2 = 0.001        pdiblcb = 3.4e-008     drout   = 0.56
+pvag    = 1e-020       delta   = 0.01         pscbe1  = 8.14e+008    pscbe2  = 9.58e-007
+fprout  = 0.2          pdits   = 0.08         pditsd  = 0.23         pditsl  = 2.3e+006
+rsh     = 5            rdsw    = 240          rsw     = 120          rdw     = 120
+rdswmin = 0            rdwmin  = 0            rswmin  = 0            prwg    = 3.22e-008
+prwb    = 6.8e-011     wr      = 1            alpha0  = 0.074        alpha1  = 0.005
+beta0   = 30           agidl   = 0.0002       bgidl   = 2.1e+009     cgidl   = 0.0002
+egidl   = 0.8
+aigbacc = 0.012        bigbacc = 0.0028       cigbacc = 0.002
+nigbacc = 1            aigbinv = 0.014        bigbinv = 0.004        cigbinv = 0.004
+eigbinv = 1.1          nigbinv = 3            aigc    = 0.69         bigc    = 0.0012
+cigc    = 0.0008       aigsd   = 0.0087       bigsd   = 0.0012       cigsd   = 0.0008
+nigc    = 1            poxedge = 1            pigcd   = 1            ntox    = 1
+xrcrg1  = 12           xrcrg2  = 5
+cgso    = 2.4e-010     cgdo    = 2.4e-010     cgbo    = 2.56e-011    cgdl    = 2.653e-10
+cgsl    = 2.653e-10    ckappas = 0.03         ckappad = 0.03         acde    = 1
+moin    = 15           noff    = 0.9          voffcv  = 0.02
+kt1     = -0.11        kt1l    = 0            kt2     = 0.022        ute     = -1.5
+ua1     = 4.31e-009    ub1     = 7.61e-018    uc1     = -5.6e-011    prt     = 0
+at      = 33000
+fnoimod = 1            tnoimod = 0
+jss     = 0.0001       jsws    = 1e-011       jswgs   = 1e-010       njs     = 1
+ijthsfwd= 0.01         ijthsrev= 0.001        bvs     = 10           xjbvs   = 1
+jsd     = 0.0001       jswd    = 1e-011       jswgd   = 1e-010       njd     = 1
+ijthdfwd= 0.01         ijthdrev= 0.001        bvd     = 10           xjbvd   = 1
+pbs     = 1            cjs     = 0.0005       mjs     = 0.5          pbsws   = 1
+cjsws   = 5e-010       mjsws   = 0.33         pbswgs  = 1            cjswgs  = 3e-010
+mjswgs  = 0.33         pbd     = 1            cjd     = 0.0005       mjd     = 0.5
+pbswd   = 1            cjswd   = 5e-010       mjswd   = 0.33         pbswgd  = 1
+cjswgd  = 5e-010       mjswgd  = 0.33         tpb     = 0.005        tcj     = 0.001
+tpbsw   = 0.005        tcjsw   = 0.001        tpbswg  = 0.005        tcjswg  = 0.001
+xtis    = 3            xtid    = 3
+dmcg    = 0e-006       dmci    = 0e-006       dmdg    = 0e-006       dmcgt   = 0e-007
+dwj     = 0.0e-008     xgw     = 0e-007       xgl     = 0e-008
+rshg    = 0.4          gbmin   = 1e-010       rbpb    = 5            rbpd    = 15
+rbps    = 15           rbdb    = 15           rbsb    = 15           ngcon   = 1
;op 10ms
.ends curr_ref

.model NMOS NMOS
.model PMOS PMOS
.lib standard.mos
.ac dec 100 1 10G
;op dec 100 1 10G
.backanno
.end